# Altium schematic sheet HMC624A.SchDoc
size A4; SheetNumber: 2; SheetTotal: 5
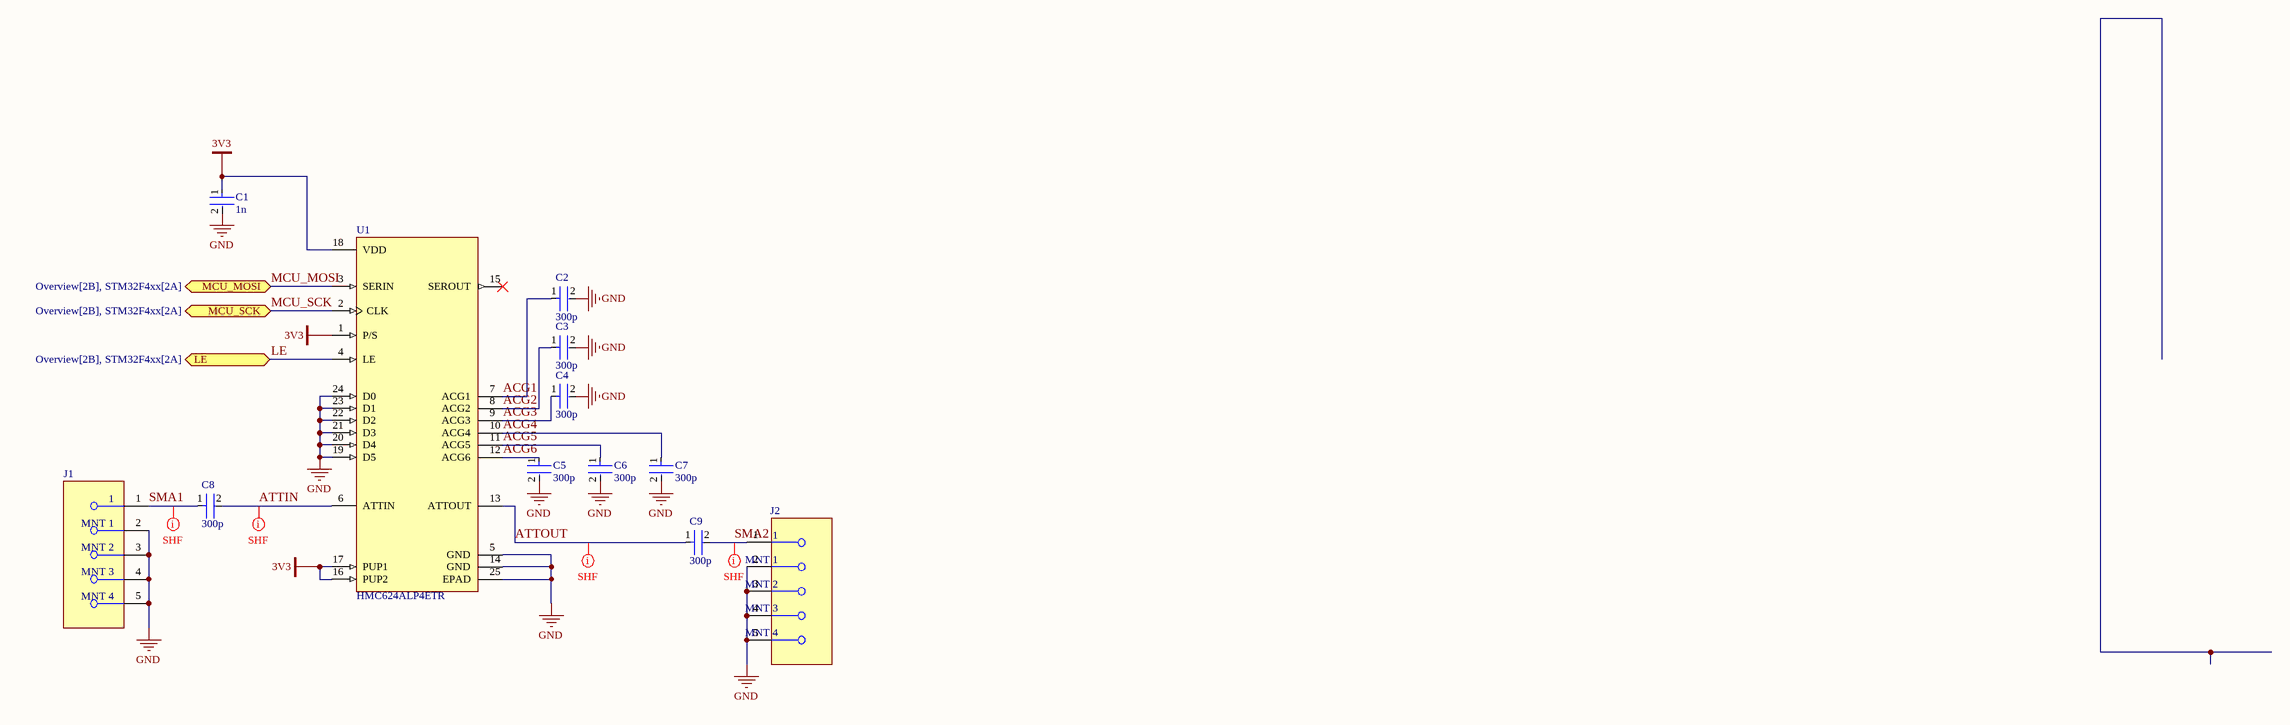
[diagram p0: HMC624A.SchDoc]

## Parts
C1  1n  [FP-C0402-BB-MFG]
C2  300p  [FP-CC0402-MFG]
C3  300p  [FP-CC0402-MFG]
C4  300p  [FP-CC0402-MFG]
C5  300p  [FP-CC0402-MFG]
C6  300p  [FP-CC0402-MFG]
C7  300p  [FP-CC0402-MFG]
C8  300p  [FP-CC0402-MFG]
C9  300p  [FP-CC0402-MFG]
J1  CON-SMA-EDGE-S  [FP-CON-SMA-EDGE-S-MFG]  (value not drawn)
J2  CON-SMA-EDGE-S  [FP-CON-SMA-EDGE-S-MFG]  (value not drawn)
U1  HMC624ALP4ETR  [FP-CP-24-16-IPC_C]

## Ports
LE (bidir, see Overview[2B], STM32F4xx[2A]), MCU_MOSI (bidir, see Overview[2B], STM32F4xx[2A]), MCU_SCK (bidir, see Overview[2B], STM32F4xx[2A])

## Nets
3V3: C1.1 U1.1(P/S) U1.16(PUP2) U1.17(PUP1) U1.18(VDD)
GND: C1.2 C2.2 C3.2 C4.2 C5.2 C6.2 C7.2 J1.2(MNT_1) J1.3(MNT_2) J1.4(MNT_3) J1.5(MNT_4) J2.2(MNT_1) J2.3(MNT_2) J2.4(MNT_3) J2.5(MNT_4) U1.5(GND) U1.14(GND) U1.19(D5) U1.20(D4) U1.21(D3) U1.22(D2) U1.23(D1) U1.24(D0) U1.25(EPAD)
ACG1: C2.1 U1.7(ACG1)
ACG2: C3.1 U1.8(ACG2)
ACG3: C4.1 U1.9(ACG3)
ACG4: C7.1 U1.10(ACG4)
ACG5: C6.1 U1.11(ACG5)
ACG6: C5.1 U1.12(ACG6)
ATTIN: C8.2 U1.6(ATTIN)
ATTOUT: C9.1 U1.13(ATTOUT)
LE: U1.4(LE) ; port LE
MCU_MOSI: U1.3(SERIN) ; port MCU_MOSI
MCU_SCK: U1.2(CLK) ; port MCU_SCK
SMA1: C8.1 J1.1
SMA2: C9.2 J2.1

Not connected (* = marked no-connect by the designer): U1 15(SEROUT)*

## Layout directives
net class SHF: ATTIN, ATTOUT, SMA1, SMA2

## Library data of the parts
C1 = CMP-2008-02329-2: Cap Ceramic 0.001uF 50V X7R 10% Pad SMD 0402 125C Automotive T/R; Manufacturer: Kemet; Manufacturer Part Number: C0402C102K5RACAUTO; Capacitance: 1,000 pF; Temperature Coefficient: 15%; Value: 1,000 pF; Tolerance: 0.1; Device Class L1: Passive Components; Lead Free: Yes; Device Class L2: Capacitors; Category: Cap; Temperature: -55°C to +125°C; Automotive: No; Temperature Range High: +125°C; Ipc Land Pattern Name: CAPC10050X50; Height: 0.55mm; Package: C0402-BB; Digikey Description: Cap Ceramic 0.001uF 50V X7R 10% Pad SMD 0402 125C Automotive T/R; Octopart: https://octopart.com/c0402c102k5racauto-kemet-34852013; Material: Ceramic; Voltage Rating: 50 V; Temperature Range Low: -55°C; ComponentLink2URL: https://content.kemet.com/datasheets/KEM_C1002_X7R_SMD.pdf; Device Class L3: Ceramic Capacitors; Temperature Characteristic: X7R; RoHS: TRUE; ComponentLink2Description: Datasheet
C2-C9 = CMP-03422-000106-1: CC0402 330 pF X7R 10.00% 25 V; Manufacturer Part Number: CC0402KRX7R8BB331; Manufacturer: YAGEO; Temperature Coefficient: 30ppm/°C; Material: Ceramic; Tolerance: 0.1; Capacitance: 330 pF; Value: 330 pF; Automotive Grade: NA; Voltage Rating: 25 V; Automotive: No; Device Class L2: Capacitors; Temperature: -55°C to +125°C; Height: 0.55mm; Category: Cap; Ipc Land Pattern Name: CAPC10050X50; ComponentLink2Description: Datasheet; ComponentLink2URL: http://www.yageo.com/documents/recent/UPY-GP_NP0_16V-to-50V_16.pdf; Device Class L1: Passive Components; Temperature Characteristic: X7R; Octopart: https://octopart.com/cc0402krx7r8bb331-yageo-80896401; Package: CC0402; Device Class L3: Ceramic Capacitors; Temperature Range Low: -55°C; Temperature Range High: +125°C; RoHS: TRUE; Lead Free: Yes; Footprint Url: http://www.yageo.com/exep/pages/download/literatures/UPY-C_GEN_24.pdf
J1 J2 = CMP-204357-000001-1: CONN SMA JACK STR EDGE MNT; Manufacturer: RF Solutions Ltd.; Impedance: 50Ω; Conn Orientation: Right Angle; Is Female: yes; Number Of Contacts: 1; Frequency: 18GHz; Shielding: true; Category: Conn; ComponentLink2URL: https://www.rfsolutions.co.uk/downloads/1498648656DS-CON-EDGE-SMA-4.pdf; Octopart: https://octopart.com/con-sma-edge-s-rf+solutions-70967450; Package: CONN_JACK; Manufacturer Part Number: CON-SMA-EDGE-S; Height: 6.35mm; Device Class L1: Connectors; Footprint Url: https://forum.upverter.com/uploads/default/original/3X/b/e/be75b907af57498775929d6d9099689c472e0307.pdf; Contact Material: Gold; ComponentLink2Description: Datasheet; Device Class L2: RF / Coaxial Connectors; RoHS: TRUE; Device Class L3: unset; Digikey Description: CONN SMA JACK STR EDGE MNT; Lead Free: Yes; Automotive: No
U1 = CMP-09141-000007-1: RF ATTENUATOR 31.5DB 50OHM 24QFN; Manufacturer: Analog Devices; Max Junction Temp: +150°C; Bandwidth: 5.9GHz; Standoff Height: 0.02mm; Max Frequency: 6GHz; Automotive: No; Device Class L3: unset; Digikey Description: RF ATTENUATOR 31.5DB 50OHM 24QFN; Category: IC; Temperature Range High: +85°C; Package: CP-24-16; Device Class L2: RF Semiconductors and Devices; ComponentLink2Description: Datasheet; Temperature: -40°C to +85°C; Octopart: https://octopart.com/hmc624alp4etr-analog+devices-51967055; ComponentLink2URL: https://www.analog.com/media/en/technical-documentation/data-sheets/hmc624a.pdf; Height: 0.9mm; Manufacturer Part Number: HMC624ALP4ETR; Mouser Description: 6Bits 0.5dBStep 31.5dB Digital Attenuator 6GHz 24-Pin QFN EP T/R; Device Class L1: Integrated Circuits (ICs); RoHS: TRUE; Footprint Url: https://www.analog.com/media/en/package-pcb-resources/package/pkg_pdf/lfcspcp/cp-24/cp_24_16.pdf; Ipc Land Pattern Name: QFN50P400X400X85-24; Lead Free: Yes; Temperature Range Low: -40°C